# Altium schematic sheet 5V_1A_LDO_SUPPLY.SchDoc
size A
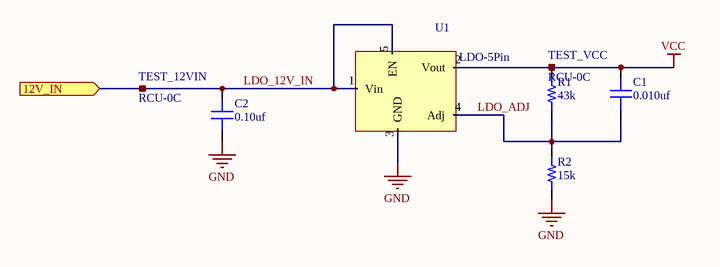
[diagram p0: 5V_1A_LDO_SUPPLY.SchDoc]

## Parts
C1  value 0.010uf  [CAP 0603/1608]  (hidden comment: Capacitor MLCC 0.010uf 16V CAP 0603/1608)
C2  value 0.10uf  [CAP 0603/1608]  (hidden comment: Capacitor MLCC 0.10uf 16V CAP 0603/1608)
R1  value 43k  [RES 0603/1608]  (hidden comment: Resistor 43k 0603 1/10W 1%)
R2  value 15k  [RES 0603/1608]  (hidden comment: Resistor 15k 0603 1/10W 1%)
TEST_12VIN  RCU-0C  [RCU-0C]
TEST_VCC  RCU-0C  [RCU-0C]
U1  LDO-5Pin  [SOT223-5]

## Ports
12V_IN (in)

## Nets
GND: C2.1 R2.1 U1.3(GND)
VCC: C1.2 R1.2 TEST_VCC.1 U1.2(Vout)
LDO_12V_IN: C2.2 TEST_12VIN.1 U1.1(Vin) U1.5(EN) ; port 12V_IN
LDO_ADJ: C1.1 R1.1 R2.2 U1.4(Adj)

## Library data of the parts
C1 = 217: Manufacturer_id: 1; idCapacitor: 217; Name: Cap_0.010uf_16V_CAP 0603/1608; Dielectric: Ceramic; Created_By: Nick Mah; Drawer_id: 1; Voltage_Rating: 16V; Package: CAP 0603/1608; Created_Date: 10/20/2018
C2 = 223: Manufacturer_id: 1; idCapacitor: 223; Name: Cap_0.10uf_16V_CAP 0603/1608; Dielectric: Ceramic; Created_By: Nick Mah; Drawer_id: 1; Voltage_Rating: 16V; Package: CAP 0603/1608; Created_Date: 10/20/2018
R1 = 328: Manufacturer_id: 1; idResistor: 328; Name: Res_43k_0603_1/10W_1%; Created_By: Nick Mah; Supplier 1: Digi-Key; Drawer_id: 1; Tolerance: 1%; Power: 1/10W; Package: 0603; ComponentLink1Description: Datasheet; Created_Date: 2018-10-20
R2 = 317: Manufacturer_id: 1; idResistor: 317; Name: Res_15k_0603_1/10W_1%; Created_By: Nick Mah; Supplier 1: Digi-Key; Drawer_id: 1; Tolerance: 1%; Power: 1/10W; Package: 0603; ComponentLink1Description: Datasheet; Created_Date: 2018-10-20
TEST_12VIN TEST_VCC = 5: Manufacturer_id: 1; idTable: 5; Name: RCU-0C_Test_Point; Drawer_id: 1; Package: 0603; MfrPartNo: RCU-0C; Link: https://www.digikey.com/product-detail/en/te-connectivity-amp-connectors/RCU-0C/A106145CT-ND/3477802; ComponentLink1Description: Datasheet; ComponentLink1URL: https://www.te.com/commerce/DocumentDelivery/DDEController?Action=srchrtrv&DocNm=1773266&DocType=DS&DocLang=English
U1 = 7: Manufacturer_id: 1; MfrPartNo: REG104GA-A; idPMIC_Lin: 7; Name: 5V 1A LDO; Value: 5V 1.A; Vin(Min): -.3V; Vin(Max): 16V; Vout(Min): 2.5V; Vout(Max): 5V; Current_Rating: 1A; Drawer_id: 1; Num_Outputs: 1; Package: SOT-223-6; Link: https://www.digikey.com/product-detail/en/texas-instruments/REG104GA-A/REG104GA-A-ND/380288?utm_adgroup=Integrated%20Circuits&slid=&gclid=CjwKCAjwpKveBRAwEiwAo4Pqm3P1cbCGhU8VzQ4hsaig_pQLQzWQ1vPK7ianKpgKPxk_g8_0T-ULMBoCGh8QAvD_BwE